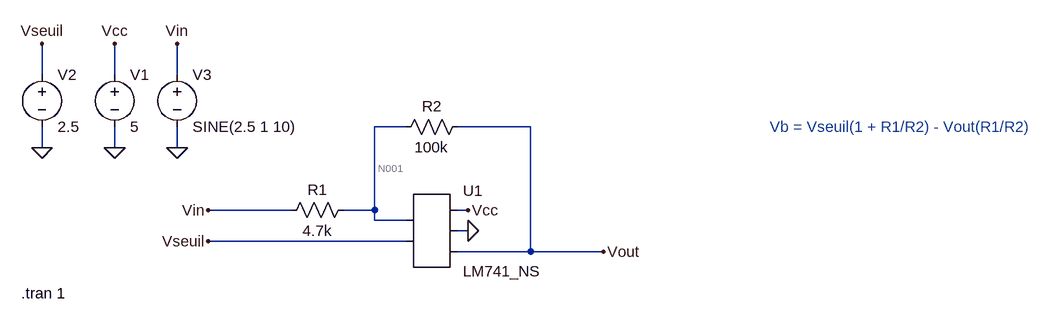
[diagram p0: schematic Trigger_Schmitt.asc]
* Trigger_Schmitt.asc
* U1: LM741_NS (symbol AutoGenerated\LM741_NS not available, pins judged from their places): pin1=N001 pin2=Vseuil pin3=Vcc pin4=0 pin5=Vout
R2 Vout N001 100k
R1 N001 Vin 4.7k
V1 Vcc 0 5
V2 Vseuil 0 2.5
V3 Vin 0 SINE(2.5 1 10)
.tran 1
* Vb = Vseuil(1 + R1/R2) - Vout(R1/R2)
.backanno
.end

* Results of the author's LTspice run, read from the files saved beside the schematic
* Operating Point, zero values left out:
*   V(vseuil) = 2.5 V
*   V(n001) = 2.499 V
*   V(vcc) = 5 V
*   V(vout) = 2.484 V
*   V(vin) = 2.5 V
*   I(R1) = -212.8 nA
*   I(R2) = -154.9 nA
*   I(V3) = -212.8 nA
*   I(V2) = -101.9 nA
*   I(V1) = -1.388 mA
*   Ix(u1:1) = 57.87 nA
*   Ix(u1:2) = 101.9 nA
*   Ix(u1:99) = 1.388 mA
*   Ix(u1:50) = -1.389 mA
*   Ix(u1:28) = 154.9 nA
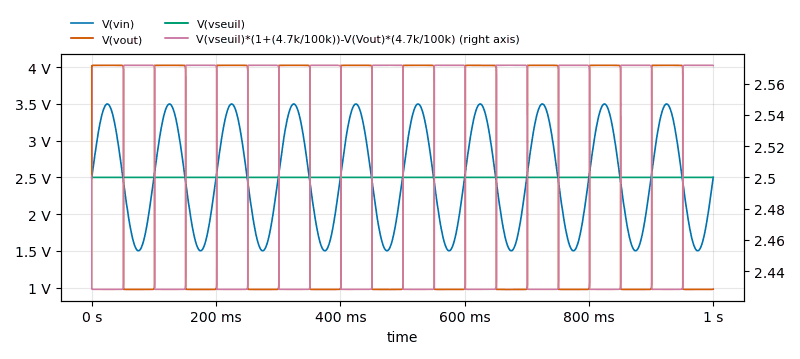
[diagram p1: Transient Analysis of Trigger_Schmitt.asc, plotted from the saved traces]
* Transient Analysis, 1 run:
*   V(vin): min 1.501 V, max 3.499 V, average 2.5 V, rms 2.598 V, last 2.5 V
*   V(vout): min 973.6 mV, max 4.027 V, average 2.504 V, rms 2.932 V, last 977.8 mV
*   V(vseuil): min 2.5 V, max 2.5 V, average 2.5 V, rms 2.5 V, last 2.5 V
*   V(vseuil)*(1+(4.7k/100k))-V(Vout)*(4.7k/100k): min 2.428 , max 2.572 , average 2.5 , rms 2.501 , last 2.572 